# Altium schematic sheet contactor-feedback-divider.SchDoc
size A3; DocumentNumber: 17; SheetNumber: 17; SheetTotal: 45; SheetDescription: Contactor Feedback Resistor Divider
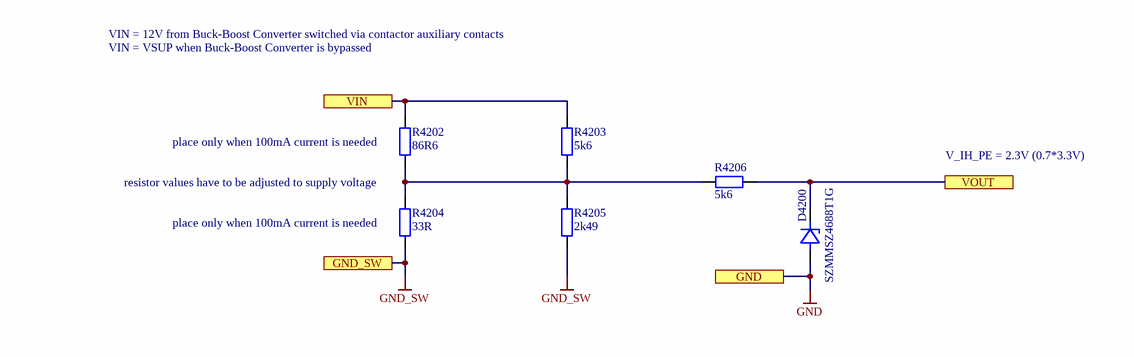
[diagram p0: contactor-feedback-divider.SchDoc]

## Parts
D4200  SZMMSZ4688T1G  [SOD-123_CASE-425-04-ISSUE-G]
R4202  86R6  [RESC5025X07N]
R4203  5k6  [RESC1005X04N]
R4204  33R  [RESC5025X07N]
R4205  2k49  [RESC1005X04N]
R4206  5k6  [RESC1005X04N]

## Ports
GND, GND_SW, VIN, VOUT

## Nets
GND: D4200.2(A) ; port GND
GND_SW: R4204.1 R4205.1 ; port GND_SW
VIN: R4202.2 R4203.2 ; port VIN
VOUT: D4200.1(K) R4206.1 ; port VOUT
NetR4202_1: R4202.1 R4203.1 R4204.2 R4205.2 R4206.2

## Notes on the sheet
- VIN = 12V from Buck-Boost Converter switched via contactor auxiliary contacts
- VIN = VSUP when Buck-Boost Converter is bypassed
- (near R4202) place only when 100mA current is needed
- resistor values have to be adjusted to supply voltage
- V_IH_PE = 2.3V (0.7*3.3V)
- (near R4204) place only when 100mA current is needed
- Fraunhofer IISB
- Schottkystr. 10
- developed by:
- 91058 Erlangen
- Germany
- Author
- Project
- License
- Description
- File
- Version
- Release Date
- Sheet
- foxbms.org <https://foxbms.org>
- www.iisb.fraunhofer.de <https://www.iisb.fraunhofer.de/>
- foxBMS Team
- /

## Library data of the parts
D4200 = SZMMSZ4688T1G: Zener Diode; Manufacturer: ON Semiconductor; Breakdown Voltage: 4.7V; PnP Package: SOD123; Automotive Qualified: True; Part Number: SZMMSZ4688T1G; Part Name: SZMMSZ4688T1G; Operating Temperature: -55°C - +150°C; ComponentLink1Description: Datasheet; ComponentLink1URL: https://www.onsemi.com/pub/Collateral/MMSZ4678T1-D.PDF; Supplier 1: Digikey; Supplier Part Number 1: SZMMSZ4688T1GOSCT-ND; Supplier 2: Farnell; Supplier Part Number 2: 2774579; Supplier 3: Mouser; Supplier Part Number 3: 863-SZMMSZ4688T1G
R4202 = gen_R_86R6_2010: SMD Resistor 86R6 2010; Tolerance: 1%; Power: 0.75W; Case EIA: 2010; Case Metric: 5025; Maximum Working Voltage: 400V; PnP Package: 2010R; Automotive Qualified: True; AEC-Q Grade: Grade 0; AEC-Q Norm: AEC-Q200; Part Number: gen_R_86R6_2010; Operating Temperature: -55°C - +155°C; Resistance: 86R6; Series: E96; PnP Value: 86R6; ECCN: EAR99; Supplier 1: Digikey; Supplier Part Number 1: 541-86.6ACCT-ND
R4203 R4206 = gen_R_5k6_0402: SMD Resistor 5k6 0402; Tolerance: 1%; Power: 0.063W; Case EIA: 0402; Case Metric: 1005; Maximum Working Voltage: 50V; PnP Package: 0402R; Automotive Qualified: True; AEC-Q Grade: Grade 0; AEC-Q Norm: AEC-Q200; Part Number: gen_R_5k6_0402; Operating Temperature: -55°C - +155°C; Resistance: 5k6; Series: E24; PnP Value: 5k6; ECCN: EAR99; Supplier 1: Digikey; Supplier Part Number 1: A129636CT-ND
R4204 = gen_R_33R_2010: SMD Resistor 33R 2010; Tolerance: 1%; Power: 0.75W; Case EIA: 2010; Case Metric: 5025; Maximum Working Voltage: 400V; PnP Package: 2010R; Automotive Qualified: True; AEC-Q Grade: Grade 0; AEC-Q Norm: AEC-Q200; Part Number: gen_R_33R_2010; Operating Temperature: -55°C - +155°C; Resistance: 33R; Series: E24; PnP Value: 33R; ECCN: EAR99; Supplier 1: Farnell; Supplier Part Number 1: 2324408
R4205 = gen_R_2k49_0402: SMD Resistor 2k49 0402; Tolerance: 1%; Power: 0.063W; Case EIA: 0402; Case Metric: 1005; Maximum Working Voltage: 50V; PnP Package: 0402R; Automotive Qualified: True; Part Number: gen_R_2k49_0402; Operating Temperature: -55°C - +155°C; Resistance: 2k49; Series: E96; PnP Value: 2k49; Supplier 1: Farnell; Supplier Part Number 1: 2059135